# EasyEDA Pro project ELECAP.eprj, schematic Schematic2
Create Date: 2024-07-21; Page Name: P1; Project Name: ELECAP; Schematic Name: Schematic2; Update Date: 2024-07-21; Company: 嘉立创EDA; Page Size: A4; Version: V1.0
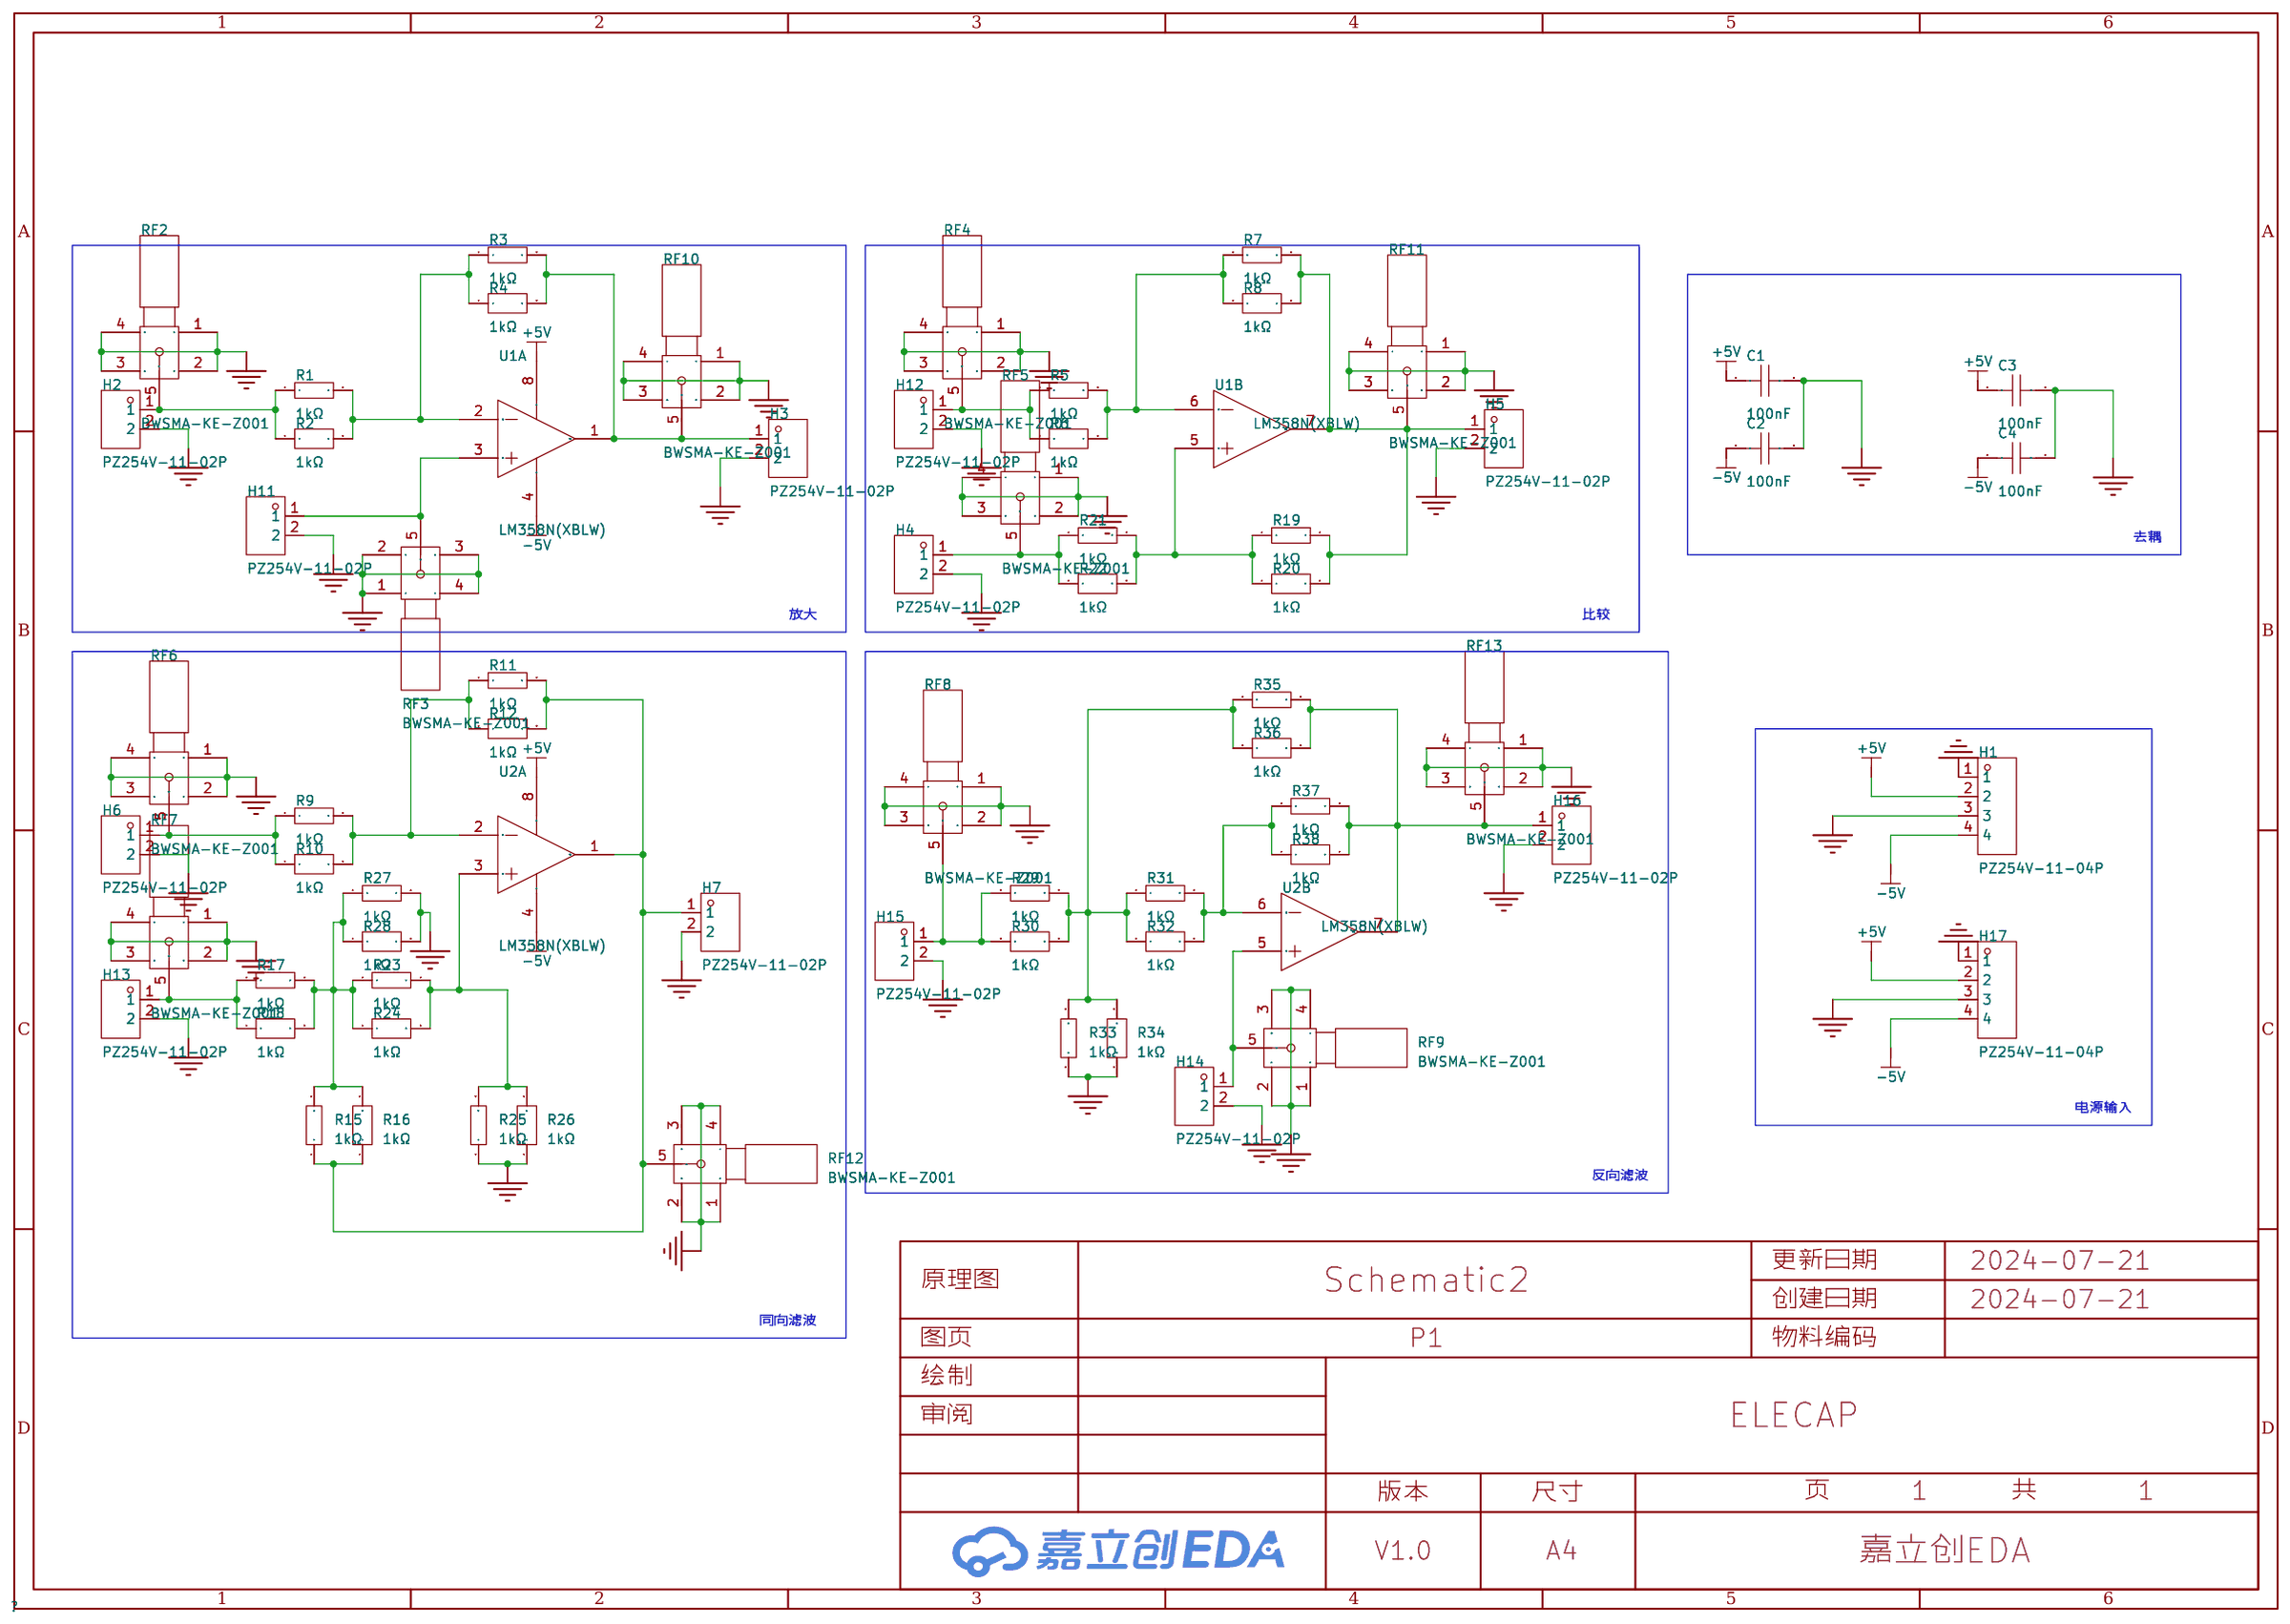
[diagram p1: schematic sheet]

## Parts
C1  100nF  [C0603]
C2  100nF  [C0603]
C3  100nF  [C0603]
C4  100nF  [C0603]
H1  PZ254V-11-04P  [HDR-TH_4P-P2.54-V-M]
H2  PZ254V-11-02P  [HDR-TH_2P-P2.54-V-M]
H3  PZ254V-11-02P  [HDR-TH_2P-P2.54-V-M]
H4  PZ254V-11-02P  [HDR-TH_2P-P2.54-V-M]
H5  PZ254V-11-02P  [HDR-TH_2P-P2.54-V-M]
H6  PZ254V-11-02P  [HDR-TH_2P-P2.54-V-M]
H7  PZ254V-11-02P  [HDR-TH_2P-P2.54-V-M]
H11  PZ254V-11-02P  [HDR-TH_2P-P2.54-V-M]
H12  PZ254V-11-02P  [HDR-TH_2P-P2.54-V-M]
H13  PZ254V-11-02P  [HDR-TH_2P-P2.54-V-M]
H14  PZ254V-11-02P  [HDR-TH_2P-P2.54-V-M]
H15  PZ254V-11-02P  [HDR-TH_2P-P2.54-V-M]
H16  PZ254V-11-02P  [HDR-TH_2P-P2.54-V-M]
H17  PZ254V-11-04P  [HDR-TH_4P-P2.54-V-M]
R1  1kΩ  [R0805]
R2  1kΩ  [RES-TH_BD2.7-L6.2-P10.20-D0.4]
R3  1kΩ  [R0805]
R4  1kΩ  [RES-TH_BD2.7-L6.2-P10.20-D0.4]
R5  1kΩ  [R0805]
R6  1kΩ  [RES-TH_BD2.7-L6.2-P10.20-D0.4]
R7  1kΩ  [R0805]
R8  1kΩ  [RES-TH_BD2.7-L6.2-P10.20-D0.4]
R9  1kΩ  [R0805]
R10  1kΩ  [RES-TH_BD2.7-L6.2-P10.20-D0.4]
R11  1kΩ  [R0805]
R12  1kΩ  [RES-TH_BD2.7-L6.2-P10.20-D0.4]
R15  1kΩ  [R0805]
R16  1kΩ  [RES-TH_BD2.7-L6.2-P10.20-D0.4]
R17  1kΩ  [R0805]
R18  1kΩ  [RES-TH_BD2.7-L6.2-P10.20-D0.4]
R19  1kΩ  [R0805]
R20  1kΩ  [RES-TH_BD2.7-L6.2-P10.20-D0.4]
R21  1kΩ  [R0805]
R22  1kΩ  [RES-TH_BD2.7-L6.2-P10.20-D0.4]
R23  1kΩ  [R0805]
R24  1kΩ  [RES-TH_BD2.7-L6.2-P10.20-D0.4]
R25  1kΩ  [R0805]
R26  1kΩ  [RES-TH_BD2.7-L6.2-P10.20-D0.4]
R27  1kΩ  [R0805]
R28  1kΩ  [RES-TH_BD2.7-L6.2-P10.20-D0.4]
R29  1kΩ  [R0805]
R30  1kΩ  [RES-TH_BD2.7-L6.2-P10.20-D0.4]
R31  1kΩ  [R0805]
R32  1kΩ  [RES-TH_BD2.7-L6.2-P10.20-D0.4]
R33  1kΩ  [R0805]
R34  1kΩ  [RES-TH_BD2.7-L6.2-P10.20-D0.4]
R35  1kΩ  [R0805]
R36  1kΩ  [RES-TH_BD2.7-L6.2-P10.20-D0.4]
R37  1kΩ  [R0805]
R38  1kΩ  [RES-TH_BD2.7-L6.2-P10.20-D0.4]
RF2  BWSMA-KE-Z001  [SMA-TH_BWSMA-KE-Z001]
RF3  BWSMA-KE-Z001  [SMA-TH_BWSMA-KE-Z001]
RF4  BWSMA-KE-Z001  [SMA-TH_BWSMA-KE-Z001]
RF5  BWSMA-KE-Z001  [SMA-TH_BWSMA-KE-Z001]
RF6  BWSMA-KE-Z001  [SMA-TH_BWSMA-KE-Z001]
RF7  BWSMA-KE-Z001  [SMA-TH_BWSMA-KE-Z001]
RF8  BWSMA-KE-Z001  [SMA-TH_BWSMA-KE-Z001]
RF9  BWSMA-KE-Z001  [SMA-TH_BWSMA-KE-Z001]
RF10  BWSMA-KE-Z001  [SMA-TH_BWSMA-KE-Z001]
RF11  BWSMA-KE-Z001  [SMA-TH_BWSMA-KE-Z001]
RF12  BWSMA-KE-Z001  [SMA-TH_BWSMA-KE-Z001]
RF13  BWSMA-KE-Z001  [SMA-TH_BWSMA-KE-Z001]
U1  LM358N(XBLW)  [PDIP-8_L9.3-W6.4-P2.54-LS7.6-BL]  (sections 1,2)
U2  LM358N(XBLW)  [PDIP-8_L9.3-W6.4-P2.54-LS7.6-BL]  (sections 1,2)

## Library data of the parts
C1-C4 = CC0603KRX7R9BB104: 容值:100nF;精度:±10%;额定电压:50V;材质(温度系数):X7R;; LCSC Part Name: 100nF ±10% 50V; Supplier Part: C14663; Manufacturer: YAGEO(国巨); Supplier Footprint: 0603; JLCPCB Part Class: 基础库; Datasheet: https://atta.szlcsc.com/upload/public/pdf/source/20180910/C282072_33301C7F631E79921B82A8DAC6BCC5B3.pdf; Supplier: LCSC; Tolerance: ±10%; Voltage Rated: 50V; Temperature Coefficient: X7R
H1 H17 = PZ254V-11-04P: 插针结构:1x4P;间距:2.54mm;行距:-;圆针/方针:方针;安装类型:直插;排数:单排;总PIN位数:4P;额定电流:3A;额定电压:250V;配合针长度:6mm;塑高:2.5mm;端接针长度:3mm;触头材质:-;工作温度范围:-40℃~+105℃;颜色:黑色;; LCSC Part Name: 间距:2.54mm 1x4P 直插 方针; Supplier Part: C2691448; Manufacturer: XFCN(兴飞); Supplier Footprint: 插件,P=2.54mm; JLCPCB Part Class: Extended Part; Datasheet: https://atta.szlcsc.com/upload/public/pdf/source/20200309/C492403_F9F19131791D08044AD4F84F8E751A34.pdf; Supplier: LCSC; Pin Structure: 1x4P; Pitch: 2.54mm; Circluar Pins/Square Pins: 方针; Mounting Type: 直插; Number of Rows: 单排; Number of Pins: 4P; Current Rating (Max): 3A; Voltage Rating (Max): 250V; Length of Mating Pin: 6mm; Insulation Height: 2.5mm; Length of End Connection Pin: 3mm; Operating Temperature Range: -40℃~+105℃; Color: 黑色
H2-H7 H11-H16 = PZ254V-11-02P: 插针结构:1x2P;间距:2.54mm;行距:-;圆针/方针:方针;安装类型:直插;排数:单排;总PIN位数:2P;额定电流:-;额定电压:-;配合针长度:6mm;塑高:2.5mm;端接针长度:3mm;触头材质:黄铜;触头镀层:-;工作温度范围:-40℃~+105℃;颜色:黑色;; LCSC Part Name: 间距:2.54mm 1x2P 直插 方针; Supplier Part: C492401; Manufacturer: XFCN(兴飞); Supplier Footprint: 插件,P=2.54mm; JLCPCB Part Class: 扩展库; Datasheet: https://atta.szlcsc.com/upload/public/pdf/source/20200309/C492401_A812433581A9B211A7FFA413ADDFF0E5.pdf; Supplier: LCSC; Pin Structure: 1x2P; Pitch: 2.54mm; Circluar Pins/Square Pins: 方针; Mounting Type: 直插; Number of Rows: 单排; Number of Pins: 2P; Length of Mating Pin: 6mm; Insulation Height: 2.5mm; Length of End Connection Pin: 3mm; Contact Material: 黄铜; Operating Temperature Range: -40℃~+105℃; Color: 黑色
R1 R3 R5 R7 R9 R11 R15 R17 R19 R21 R23 R25 R27 R29 R31 R33 R35 R37 = 0805W8F1001T5E: 电阻类型:厚膜电阻;阻值:1kΩ;精度:±1%;功率:125mW;最大工作电压:150V;温度系数:±100ppm/℃;; LCSC Part Name: 1kΩ ±1% 125mW 厚膜电阻; Supplier Part: C17513; Manufacturer: UNI-ROYAL(厚声); Supplier Footprint: 0805; JLCPCB Part Class: 基础库; Datasheet: https://atta.szlcsc.com/upload/public/pdf/source/20200306/C422600_1E6D84923E4A46A82E41ADD87F860B5C.pdf; Supplier: LCSC; Type: 厚膜电阻; Tolerance: ±1%; Power(Watts): 125mW; Overload Voltage (Max): 150V; Temperature Coefficient: ±100ppm/℃; Operating Temperature Range: -55℃~+155℃
R2 R4 R6 R8 R10 R12 R16 R18 R20 R22 R24 R26 R28 R30 R32 R34 R36 R38 = MF1/4W-1K±1%-ST52: 电阻类型:金属膜电阻;阻值:1kΩ;精度:±1%;功率:250mW;温度系数:±100ppm/℃;; LCSC Part Name: 金属膜电阻 1kΩ ±1% 250mW; Supplier Part: C2903245; Manufacturer: VO(翔胜); Supplier Footprint: 插件,D2.7xL6.2mm; JLCPCB Part Class: Extended Part; Datasheet: https://atta.szlcsc.com/upload/public/pdf/source/20200609/C601728_5AA4C0C8E12E11069DA2C3356F29D1F2.pdf; Supplier: LCSC; Type: 金属膜电阻; Tolerance: ±1%; Overload Voltage (Max): 250V; Power(Watts): 250mW; Temperature Coefficient: ±100ppm/℃; Operating Temperature Range: -55℃~+155℃
RF2-RF13 = BWSMA-KE-Z001_C496549: 连接器类型:板端;接口类型:内孔;端口数量:1;接口直径:-;接口长度/高度:-;频率-最大值:-;射频系列:SMA;阻抗:50Ω;样式:正脚;触头材质:-;触头镀层:-;工作温度范围:-65℃~+165℃;焊接温度(最大值):-;; LCSC Part Name: 内孔 SMA 正脚; Supplier Part: C496549; Manufacturer: BAT WIRELESS(蝙蝠无线); Supplier Footprint: 插件; JLCPCB Part Class: 扩展库; Datasheet: https://atta.szlcsc.com/upload/public/pdf/source/20221228/40BF41E56A06003A0210E1785CA66EA6.pdf; Supplier: LCSC; Connector Type: 板端; Interface Type: 内孔; Number of Ports: 1; RF Series: SMA; Impedance: 50Ω; Style: 正脚; Operating Temperature Range: -65℃~+165℃
U1 U2 = LM358N(XBLW): 放大器数:双路;增益带宽积(GBP):1MHz;输入偏置电流(Ib):300nA;输入失调电压(Vos):5mV;压摆率(SR):0.6V/us;; LCSC Part Name: LM358N; Supplier Part: C18723615; Manufacturer: XBLW(芯伯乐); Supplier Footprint: DIP-8; JLCPCB Part Class: 扩展库; Datasheet: https://atta.szlcsc.com/upload/public/pdf/source/20231019/5D5266BD565DC949181482F46BBEC63B.pdf; Supplier: LCSC; Number of Circuits: 双路; Gain Bandwidth Product(GBP): 1MHz; Current - Input Bias(Ib): 300nA; Voltage - Input Offset(Vos): 5mV; Common Mode Rejection Ratio (CMRR): 90dB; Slew Rate(SR): 0.6V/us; Supply Voltage: 3V~32V; Supply Current: 500uA; Operating Temperature: 0℃~+70℃

## Nets
+5V: C1.1 C3.1 H1.2 H17.2 U1.8(V+) U2.8(V+)
-5V: C2.1 C4.1 H1.4 H17.4 U1.4(V-) U2.4(V-)
GND: C1.2 C2.2 C3.2 C4.2 H1.1 H1.3 H2.2 H3.2 H4.2 H5.2 H6.2 H7.2 H11.2 H12.2 H13.2 H14.2 H15.2 H16.2 H17.1 H17.3 R25.1 R26.1 R27.2 R28.2 R33.1 R34.1 RF2.1 RF2.2 RF2.3 RF2.4 RF3.1 RF3.2 RF3.3 RF3.4 RF4.1 RF4.2 RF4.3 RF4.4 RF5.1 RF5.2 RF5.3 RF5.4 RF6.1 RF6.2 RF6.3 RF6.4 RF7.1 RF7.2 RF7.3 RF7.4 RF8.1 RF8.2 RF8.3 RF8.4 RF9.1 RF9.2 RF9.3 RF9.4 RF10.1 RF10.2 RF10.3 RF10.4 RF11.1 RF11.2 RF11.3 RF11.4 RF12.1 RF12.2 RF12.3 RF12.4 RF13.1 RF13.2 RF13.3 RF13.4
$1N792: H2.1 R1.1 R2.1 RF2.5
$1N806: R1.2 R2.2 R3.1 R4.1 U1.2(IN A-)
$1N1003: H3.1 R3.2 R4.2 RF10.5 U1.1(OUT A)
$1N1486: H12.1 R5.1 R6.1 RF4.5
$1N1503: R5.2 R6.2 R7.1 R8.1 U1.6(IN B-)
$1N2007: H6.1 R9.1 R10.1 RF6.5
$1N2050: R9.2 R10.2 R11.1 R12.1 U2.2(IN A-)
$1N2612: H13.1 R17.1 R18.1 RF7.5
$1N3257: H11.1 RF3.5 U1.3(IN A+)
$1N3415: R19.1 R20.1 R21.2 R22.2 U1.5(IN B+)
$1N3432: H5.1 R7.2 R8.2 R19.2 R20.2 RF11.5 U1.7(OUT B)
$1N3534: H4.1 R21.1 R22.1 RF5.5
$1N4070: R23.2 R24.2 R25.2 R26.2 U2.3(IN A+)
$1N4142: H7.1 R11.2 R12.2 R15.1 R16.1 RF12.5 U2.1(OUT A)
$1N4280: R15.2 R16.2 R17.2 R18.2 R23.1 R24.1 R27.1 R28.1
$1N4445: H14.1 RF9.5 U2.5(IN B+)
$1N5039: R29.2 R30.2 R31.1 R32.1 R33.2 R34.2 R35.1 R36.1
$1N5066: R31.2 R32.2 R37.1 R38.1 U2.6(IN B-)
$1N5138: H16.1 R35.2 R36.2 R37.2 R38.2 RF13.5 U2.7(OUT B)
$1N6045: H15.1 R29.1 R30.1 RF8.5

## Notes on the sheet
- 去耦
- 放大
- 比较
- 电源输入
- 反向滤波
- 同向滤波
